# Altium schematic sheet SupplyBox.SchDoc
size C; SheetNumber: 1; SheetTotal: 1
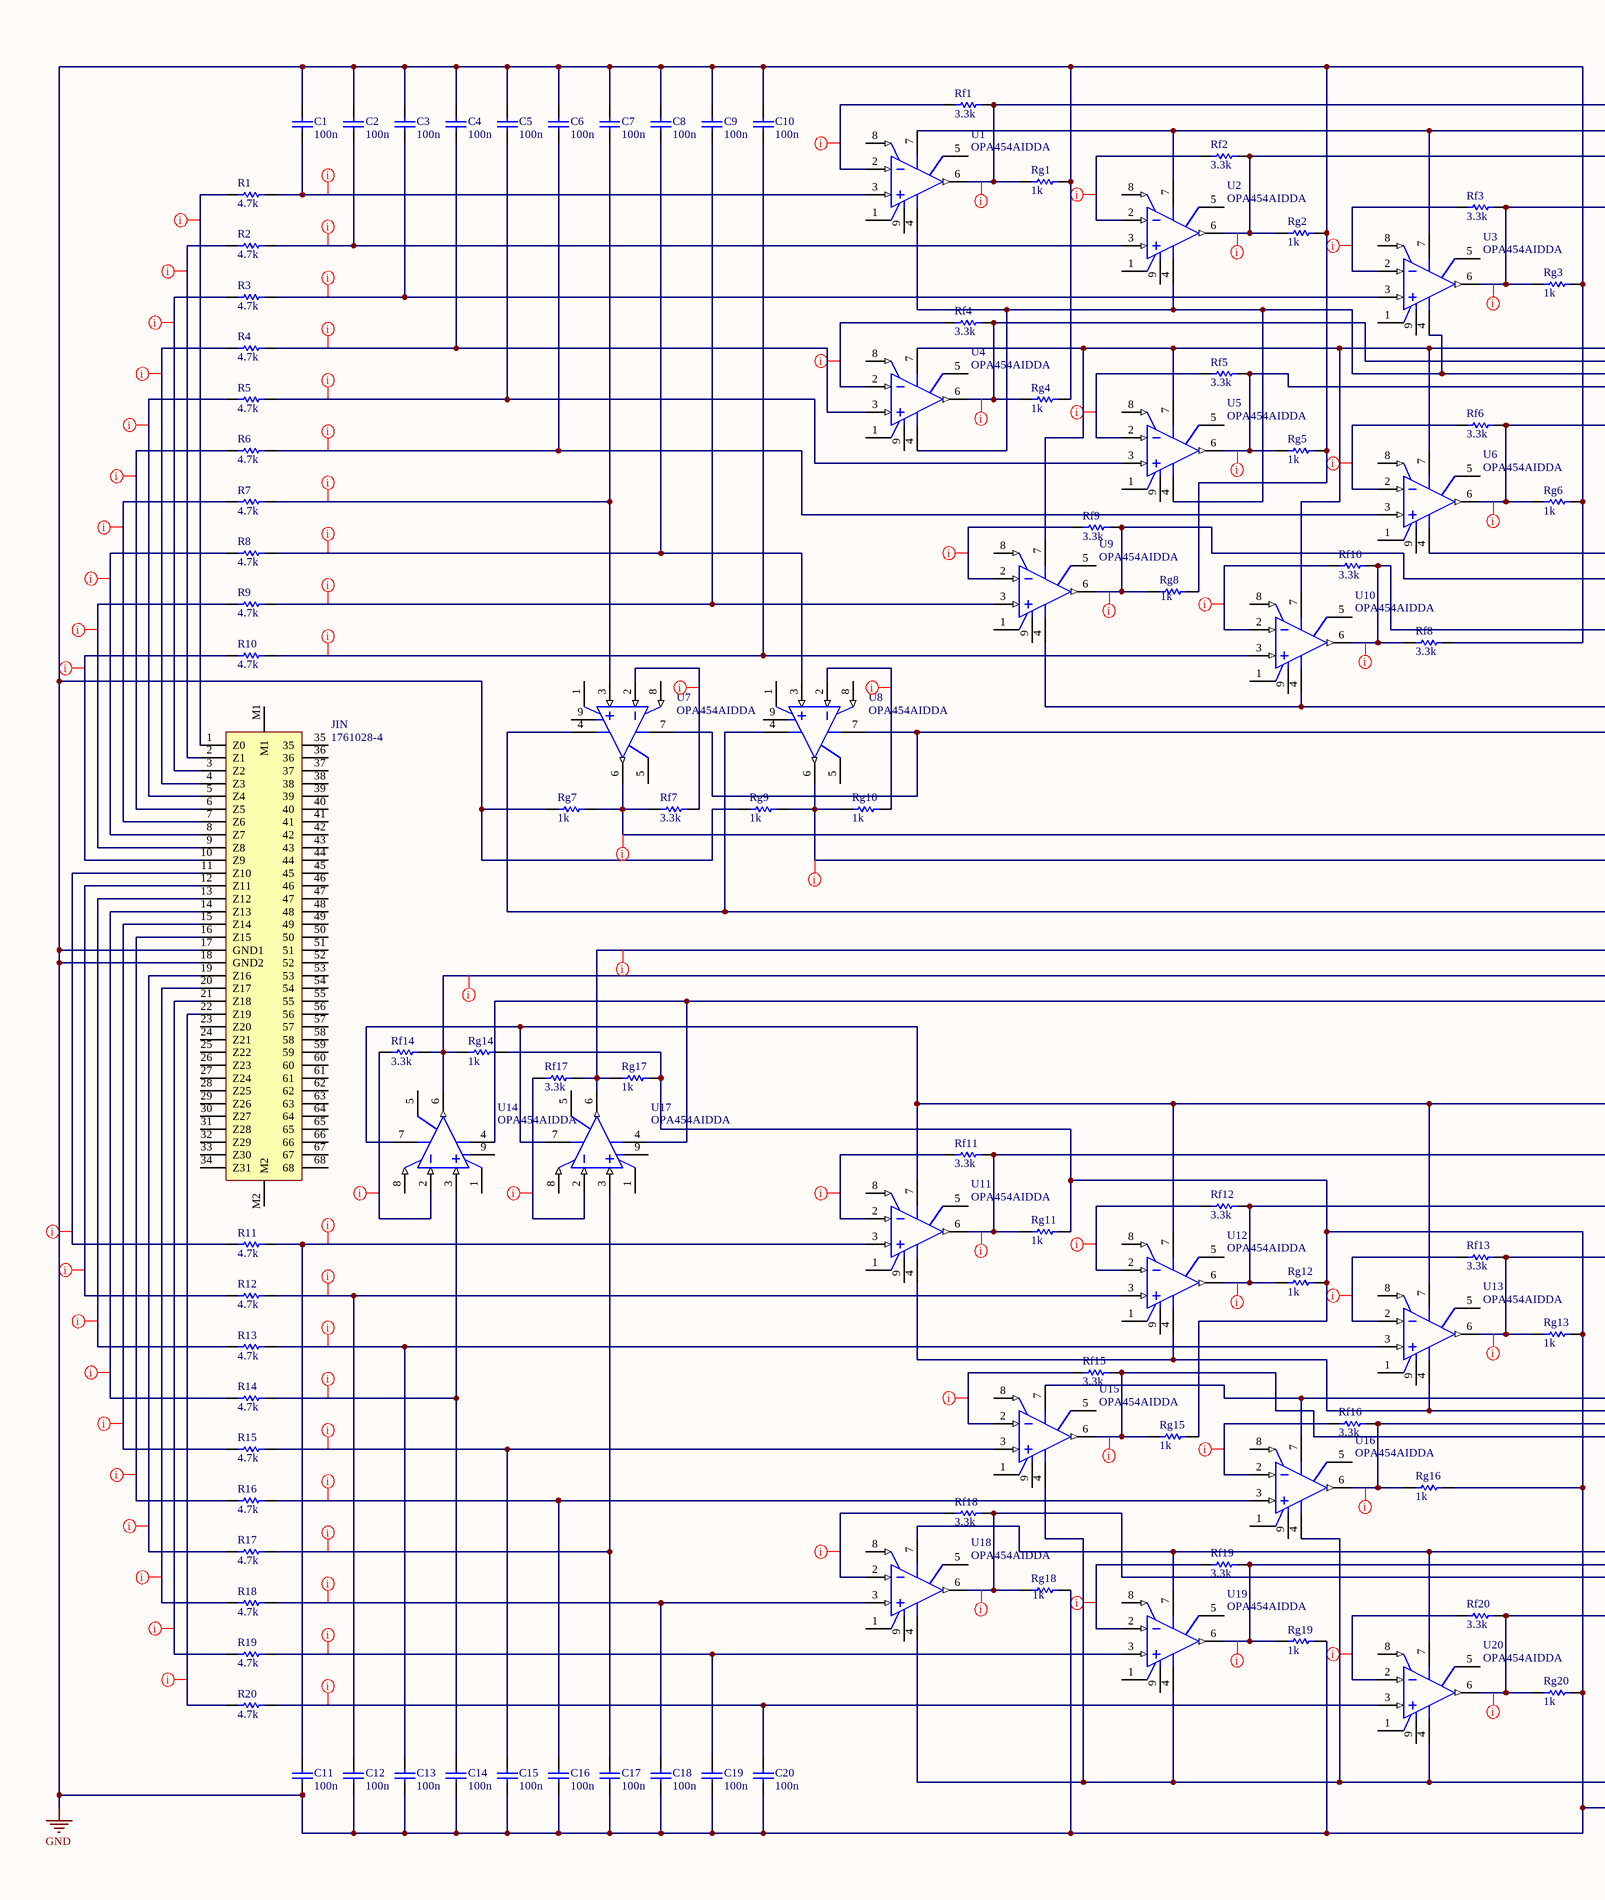
[diagram p0: SupplyBox.SchDoc, left]
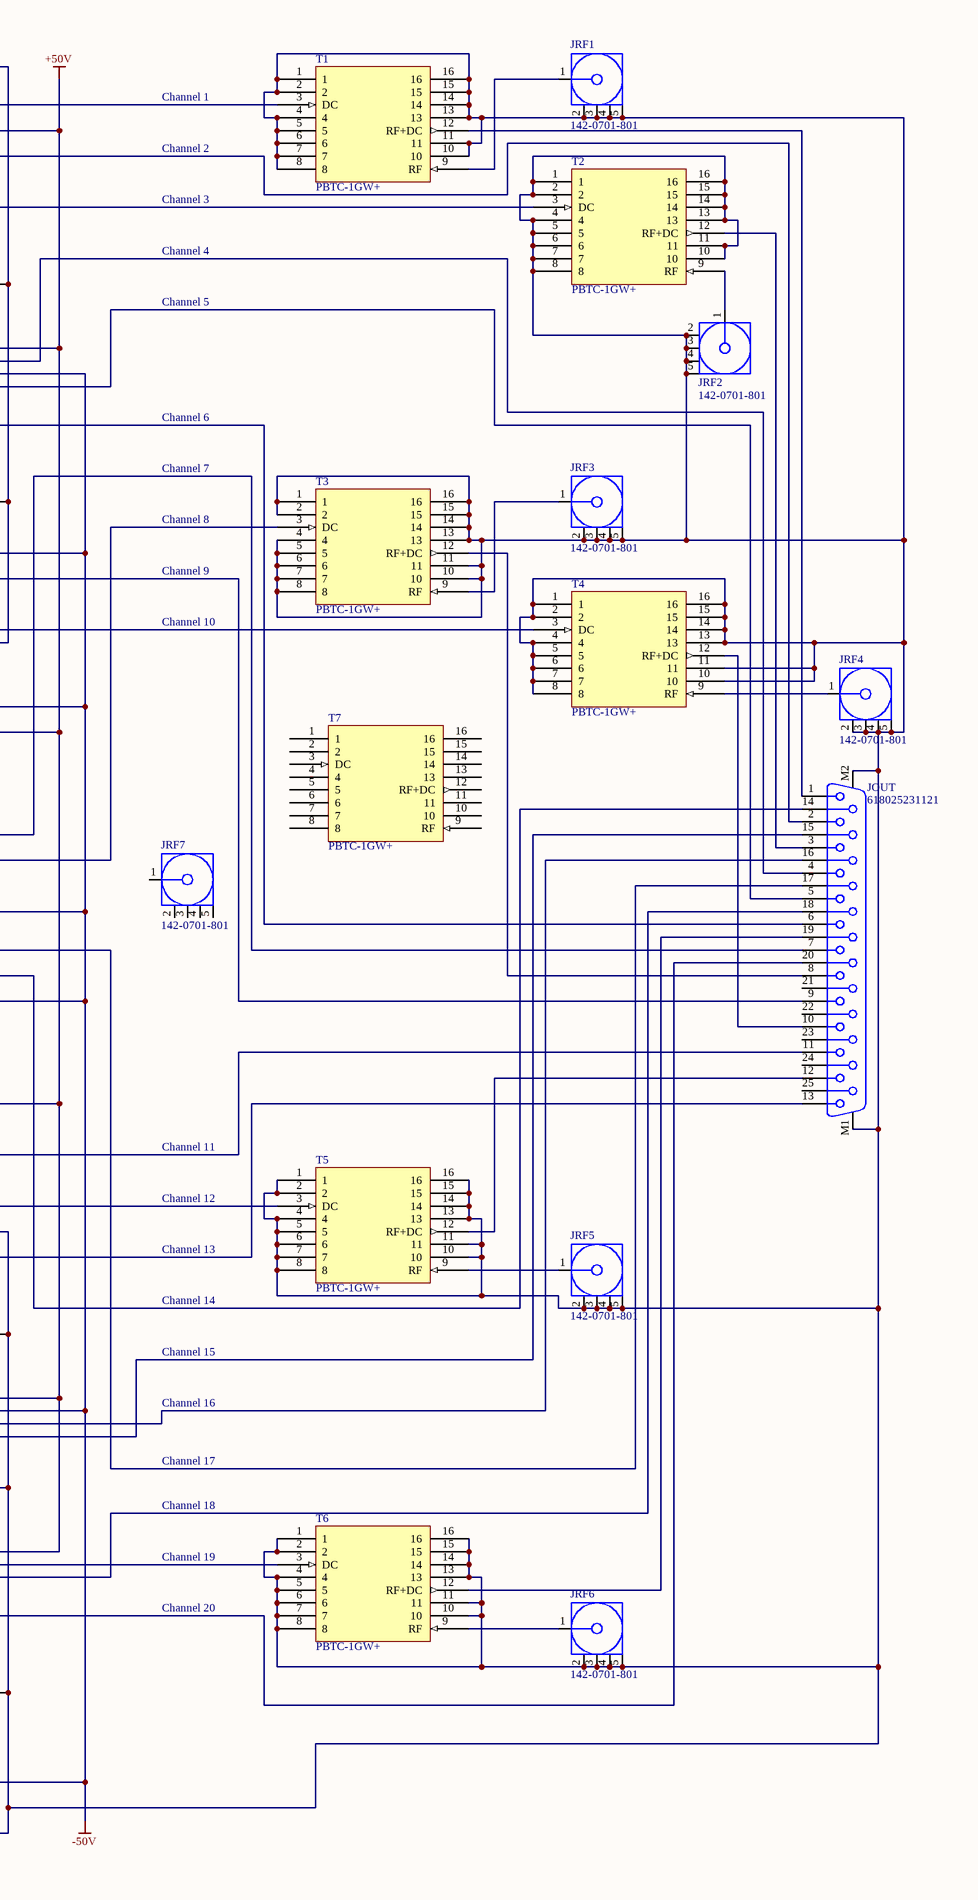
[diagram p1: SupplyBox.SchDoc, right]

## Parts
C1  100n  [CAPC2013X145X48NL20T23]
C2  100n  [CAPC2013X145X48NL20T23]
C3  100n  [CAPC2013X145X48NL20T23]
C4  100n  [CAPC2013X145X48NL20T23]
C5  100n  [CAPC2013X145X48NL20T23]
C6  100n  [CAPC2013X145X48NL20T23]
C7  100n  [CAPC2013X145X48NL20T23]
C8  100n  [CAPC2013X145X48NL20T23]
C9  100n  [CAPC2013X145X48NL20T23]
C10  100n  [CAPC2013X145X48NL20T23]
C11  100n  [CAPC2013X145X48NL20T23]
C12  100n  [CAPC2013X145X48NL20T23]
C13  100n  [CAPC2013X145X48NL20T23]
C14  100n  [CAPC2013X145X48NL20T23]
C15  100n  [CAPC2013X145X48NL20T23]
C16  100n  [CAPC2013X145X48NL20T23]
C17  100n  [CAPC2013X145X48NL20T23]
C18  100n  [CAPC2013X145X48NL20T23]
C19  100n  [CAPC2013X145X48NL20T23]
C20  100n  [CAPC2013X145X48NL20T23]
JIN  1761028-4  [1761028-4-Footprint-1]
JOUT  618025231121  [618025231121]
JRF1  142-0701-801  [CINC-142-0701-801_V]
JRF2  142-0701-801  [CINC-142-0701-801_V]
JRF3  142-0701-801  [CINC-142-0701-801_V]
JRF4  142-0701-801  [CINC-142-0701-801_V]
JRF5  142-0701-801  [CINC-142-0701-801_V]
JRF6  142-0701-801  [CINC-142-0701-801_V]
JRF7  142-0701-801  [CINC-142-0701-801_V]
R1  4.7k  [RESC2013X60X35NL10T20]
R2  4.7k  [RESC2013X60X35NL10T20]
R3  4.7k  [RESC2013X60X35NL10T20]
R4  4.7k  [RESC2013X60X35NL10T20]
R5  4.7k  [RESC2013X60X35NL10T20]
R6  4.7k  [RESC2013X60X35NL10T20]
R7  4.7k  [RESC2013X60X35NL10T20]
R8  4.7k  [RESC2013X60X35NL10T20]
R9  4.7k  [RESC2013X60X35NL10T20]
R10  4.7k  [RESC2013X60X35NL10T20]
R11  4.7k  [RESC2013X60X35NL10T20]
R12  4.7k  [RESC2013X60X35NL10T20]
R13  4.7k  [RESC2013X60X35NL10T20]
R14  4.7k  [RESC2013X60X35NL10T20]
R15  4.7k  [RESC2013X60X35NL10T20]
R16  4.7k  [RESC2013X60X35NL10T20]
R17  4.7k  [RESC2013X60X35NL10T20]
R18  4.7k  [RESC2013X60X35NL10T20]
R19  4.7k  [RESC2013X60X35NL10T20]
R20  4.7k  [RESC2013X60X35NL10T20]
Rf1  3.3k  [RESC2013X60X35ML10T20]
Rf2  3.3k  [RESC2013X60X35ML10T20]
Rf3  3.3k  [RESC2013X60X35ML10T20]
Rf4  3.3k  [RESC2013X60X35ML10T20]
Rf5  3.3k  [RESC2013X60X35ML10T20]
Rf6  3.3k  [RESC2013X60X35ML10T20]
Rf7  3.3k  [RESC2013X60X35ML10T20]
Rf8  3.3k  [RESC2013X60X35ML10T20]
Rf9  3.3k  [RESC2013X60X35ML10T20]
Rf10  3.3k  [RESC2013X60X35ML10T20]
Rf11  3.3k  [RESC2013X60X35ML10T20]
Rf12  3.3k  [RESC2013X60X35ML10T20]
Rf13  3.3k  [RESC2013X60X35ML10T20]
Rf14  3.3k  [RESC2013X60X35ML10T20]
Rf15  3.3k  [RESC2013X60X35ML10T20]
Rf16  3.3k  [RESC2013X60X35ML10T20]
Rf17  3.3k  [RESC2013X60X35ML10T20]
Rf18  3.3k  [RESC2013X60X35ML10T20]
Rf19  3.3k  [RESC2013X60X35ML10T20]
Rf20  3.3k  [RESC2013X60X35ML10T20]
Rg1  1k  [RESC2013X60X35ML10T20]
Rg2  1k  [RESC2013X60X35ML10T20]
Rg3  1k  [RESC2013X60X35ML10T20]
Rg4  1k  [RESC2013X60X35ML10T20]
Rg5  1k  [RESC2013X60X35ML10T20]
Rg6  1k  [RESC2013X60X35ML10T20]
Rg7  1k  [RESC2013X60X35ML10T20]
Rg8  1k  [RESC2013X60X35ML10T20]
Rg9  1k  [RESC2013X60X35ML10T20]
Rg10  1k  [RESC2013X60X35ML10T20]
Rg11  1k  [RESC2013X60X35ML10T20]
Rg12  1k  [RESC2013X60X35ML10T20]
Rg13  1k  [RESC2013X60X35ML10T20]
Rg14  1k  [RESC2013X60X35ML10T20]
Rg15  1k  [RESC2013X60X35ML10T20]
Rg16  1k  [RESC2013X60X35ML10T20]
Rg17  1k  [RESC2013X60X35ML10T20]
Rg18  1k  [RESC2013X60X35ML10T20]
Rg19  1k  [RESC2013X60X35ML10T20]
Rg20  1k  [RESC2013X60X35ML10T20]
T1  PBTC-1GW+  [PBTC-1GW+]
T2  PBTC-1GW+  [PBTC-1GW+]
T3  PBTC-1GW+  [PBTC-1GW+]
T4  PBTC-1GW+  [PBTC-1GW+]
T5  PBTC-1GW+  [PBTC-1GW+]
T6  PBTC-1GW+  [PBTC-1GW+]
T7  PBTC-1GW+  [PBTC-1GW+]
U1  OPA454AIDDA  [DDA0008C_L]
U2  OPA454AIDDA  [DDA0008C_L]
U3  OPA454AIDDA  [DDA0008C_L]
U4  OPA454AIDDA  [DDA0008C_L]
U5  OPA454AIDDA  [DDA0008C_L]
U6  OPA454AIDDA  [DDA0008C_L]
U7  OPA454AIDDA  [DDA0008C_L]
U8  OPA454AIDDA  [DDA0008C_L]
U9  OPA454AIDDA  [DDA0008C_L]
U10  OPA454AIDDA  [DDA0008C_L]
U11  OPA454AIDDA  [DDA0008C_L]
U12  OPA454AIDDA  [DDA0008C_L]
U13  OPA454AIDDA  [DDA0008C_L]
U14  OPA454AIDDA  [DDA0008C_L]
U15  OPA454AIDDA  [DDA0008C_L]
U16  OPA454AIDDA  [DDA0008C_L]
U17  OPA454AIDDA  [DDA0008C_L]
U18  OPA454AIDDA  [DDA0008C_L]
U19  OPA454AIDDA  [DDA0008C_L]
U20  OPA454AIDDA  [DDA0008C_L]

## Nets
+50V: U1.7(V+) U2.7(V+) U3.7(V+) U4.7(V+) U5.7(V+) U6.7(V+) U7.7(V+) U8.7(V+) U9.7(V+) U10.7(V+) U11.7(V+) U12.7(V+) U13.7(V+) U14.7(V+) U15.7(V+) U16.7(V+) U17.7(V+) U18.7(V+) U19.7(V+) U20.7(V+)
-50V: U1.4(V-) U2.4(V-) U3.4(V-) U4.4(V-) U5.4(V-) U6.4(V-) U7.4(V-) U8.4(V-) U9.4(V-) U10.4(V-) U11.4(V-) U12.4(V-) U13.4(V-) U14.4(V-) U15.4(V-) U16.4(V-) U17.4(V-) U18.4(V-) U19.4(V-) U20.4(V-)
GND: C1.2 C2.2 C3.2 C4.2 C5.2 C6.2 C7.2 C8.2 C9.2 C10.2 C11.1 C12.1 C13.1 C14.1 C15.1 C16.1 C17.1 C18.1 C19.1 C20.1 JIN.17(GND1) JIN.18(GND2) JOUT.M1 JOUT.M2 JRF1.2 JRF1.3 JRF1.4 JRF1.5 JRF2.2 JRF2.3 JRF2.4 JRF2.5 JRF3.2 JRF3.3 JRF3.4 JRF3.5 JRF4.2 JRF4.3 JRF4.4 JRF4.5 JRF5.2 JRF5.3 JRF5.4 JRF5.5 JRF6.2 JRF6.3 JRF6.4 JRF6.5 Rf8.2 Rg1.2 Rg2.2 Rg3.2 Rg4.2 Rg5.2 Rg6.2 Rg7.1 Rg8.2 Rg9.1 Rg11.2 Rg12.2 Rg13.2 Rg14.2 Rg15.2 Rg16.2 Rg17.2 Rg18.2 Rg19.2 Rg20.2 T1.1 T1.2 T1.4 T1.5 T1.6 T1.7 T1.8 T1.10 T1.11 T1.13 T1.14 T1.15 T1.16 T2.1 T2.2 T2.4 T2.5 T2.6 T2.7 T2.8 T2.10 T2.11 T2.13 T2.14 T2.15 T2.16 T3.1 T3.2 T3.4 T3.5 T3.6 T3.7 T3.8 T3.10 T3.11 T3.13 T3.14 T3.15 T3.16 T4.1 T4.2 T4.4 T4.5 T4.6 T4.7 T4.8 T4.10 T4.11 T4.13 T4.14 T4.15 T4.16 T5.1 T5.2 T5.4 T5.5 T5.6 T5.7 T5.8 T5.10 T5.11 T5.13 T5.14 T5.15 T5.16 T6.1 T6.2 T6.4 T6.5 T6.6 T6.7 T6.8 T6.10 T6.11 T6.13 T6.14 T6.15 T6.16
NetC1_1: C1.1 R1.2 U1.3(IN+)
NetC2_1: C2.1 R2.2 U2.3(IN+)
NetC3_1: C3.1 R3.2 U3.3(IN+)
NetC4_1: C4.1 R4.2 U4.3(IN+)
NetC5_1: C5.1 R5.2 U5.3(IN+)
NetC6_1: C6.1 R6.2 U6.3(IN+)
NetC7_1: C7.1 R7.2 U7.3(IN+)
NetC8_1: C8.1 R8.2 U8.3(IN+)
NetC9_1: C9.1 R9.2 U9.3(IN+)
NetC10_1: C10.1 R10.2 U10.3(IN+)
NetC11_2: C11.2 R11.2 U11.3(IN+)
NetC12_2: C12.2 R12.2 U12.3(IN+)
NetC13_2: C13.2 R13.2 U13.3(IN+)
NetC14_2: C14.2 R14.2 U14.3(IN+)
NetC15_2: C15.2 R15.2 U15.3(IN+)
NetC16_2: C16.2 R16.2 U16.3(IN+)
NetC17_2: C17.2 R17.2 U17.3(IN+)
NetC18_2: C18.2 R18.2 U18.3(IN+)
NetC19_2: C19.2 R19.2 U19.3(IN+)
NetC20_2: C20.2 R20.2 U20.3(IN+)
NetJIN_1: JIN.1(Z0) R1.1
NetJIN_2: JIN.2(Z1) R2.1
NetJIN_3: JIN.3(Z2) R3.1
NetJIN_4: JIN.4(Z3) R4.1
NetJIN_5: JIN.5(Z4) R5.1
NetJIN_6: JIN.6(Z5) R6.1
NetJIN_7: JIN.7(Z6) R7.1
NetJIN_8: JIN.8(Z7) R8.1
NetJIN_9: JIN.9(Z8) R9.1
NetJIN_10: JIN.10(Z9) R10.1
NetJIN_11: JIN.11(Z10) R11.1
NetJIN_12: JIN.12(Z11) R12.1
NetJIN_13: JIN.13(Z12) R13.1
NetJIN_14: JIN.14(Z13) R14.1
NetJIN_15: JIN.15(Z14) R15.1
NetJIN_16: JIN.16(Z15) R16.1
NetJIN_19: JIN.19(Z16) R17.1
NetJIN_20: JIN.20(Z17) R18.1
NetJIN_21: JIN.21(Z18) R19.1
NetJIN_22: JIN.22(Z19) R20.1
NetJOUT_1: JOUT.1 T1.12(RF+DC)
NetJOUT_2: JOUT.2 Rf2.2 Rg2.1 U2.6(OUT)
NetJOUT_3: JOUT.3 T2.12(RF+DC)
NetJOUT_4: JOUT.4 Rf4.2 Rg4.1 U4.6(OUT)
NetJOUT_5: JOUT.5 Rf5.2 Rg5.1 U5.6(OUT)
NetJOUT_6: JOUT.6 Rf6.2 Rg6.1 U6.6(OUT)
NetJOUT_7: JOUT.7 Rf7.1 Rg7.2 U7.6(OUT)
NetJOUT_8: JOUT.8 T3.12(RF+DC)
NetJOUT_9: JOUT.9 Rf9.2 Rg8.1 U9.6(OUT)
NetJOUT_10: JOUT.10 T4.12(RF+DC)
NetJOUT_11: JOUT.11 Rf11.2 Rg11.1 U11.6(OUT)
NetJOUT_12: JOUT.12 T5.12(RF+DC)
NetJOUT_13: JOUT.13 Rf13.2 Rg13.1 U13.6(OUT)
NetJOUT_14: JOUT.14 Rf14.2 Rg14.1 U14.6(OUT)
NetJOUT_15: JOUT.15 Rf15.2 Rg15.1 U15.6(OUT)
NetJOUT_16: JOUT.16 Rf16.2 Rg16.1 U16.6(OUT)
NetJOUT_17: JOUT.17 Rf17.2 Rg17.1 U17.6(OUT)
NetJOUT_18: JOUT.18 Rf18.2 Rg18.1 U18.6(OUT)
NetJOUT_19: JOUT.19 T6.12(RF+DC)
NetJOUT_20: JOUT.20 Rf20.2 Rg20.1 U20.6(OUT)
NetJRF1_1: JRF1.1 T1.9(RF)
NetJRF2_1: JRF2.1 T2.9(RF)
NetJRF3_1: JRF3.1 T3.9(RF)
NetJRF4_1: JRF4.1 T4.9(RF)
NetJRF5_1: JRF5.1 T5.9(RF)
NetJRF6_1: JRF6.1 T6.9(RF)
NetRf1_1: Rf1.1 U1.2(IN-)
NetRf1_2: Rf1.2 Rg1.1 T1.3(DC) U1.6(OUT)
NetRf2_1: Rf2.1 U2.2(IN-)
NetRf3_1: Rf3.1 U3.2(IN-)
NetRf3_2: Rf3.2 Rg3.1 T2.3(DC) U3.6(OUT)
NetRf4_1: Rf4.1 U4.2(IN-)
NetRf5_1: Rf5.1 U5.2(IN-)
NetRf6_1: Rf6.1 U6.2(IN-)
NetRf7_2: Rf7.2 U7.2(IN-)
NetRf8_1: Rf8.1 Rf10.2 T4.3(DC) U10.6(OUT)
NetRf9_1: Rf9.1 U9.2(IN-)
NetRf10_1: Rf10.1 U10.2(IN-)
NetRf11_1: Rf11.1 U11.2(IN-)
NetRf12_1: Rf12.1 U12.2(IN-)
NetRf12_2: Rf12.2 Rg12.1 T5.3(DC) U12.6(OUT)
NetRf13_1: Rf13.1 U13.2(IN-)
NetRf14_1: Rf14.1 U14.2(IN-)
NetRf15_1: Rf15.1 U15.2(IN-)
NetRf16_1: Rf16.1 U16.2(IN-)
NetRf17_1: Rf17.1 U17.2(IN-)
NetRf18_1: Rf18.1 U18.2(IN-)
NetRf19_1: Rf19.1 U19.2(IN-)
NetRf19_2: Rf19.2 Rg19.1 T6.3(DC) U19.6(OUT)
NetRf20_1: Rf20.1 U20.2(IN-)
NetRg9_2: Rg9.2 Rg10.1 T3.3(DC) U8.6(OUT)
NetRg10_2: Rg10.2 U8.2(IN-)

Not connected (* = marked no-connect by the designer): JIN 23(Z20) 24(Z21) 25(Z22) 26(Z23) 27(Z24) 28(Z25) 29(Z26) 30(Z27) 31(Z28) 32(Z29) 33(Z30) 34(Z31) 35 36 37 38 39 40 41 42 43 44 45 46 47 48 49 50 51 52 53 54 55 56 57 58 59 60 61 62 63 64 65 66 67 68 M1 M2; JOUT 21 22 23 24 25; JRF7 1 2 3 4 5; T7 1 2 3(DC) 4 5 6 7 8 9(RF) 10 11 12(RF+DC) 13 14 15 16; U1 1(E/D_COM) 5(STATUS_FLAG) 8(E/D) 9(EP); U2 1(E/D_COM) 5(STATUS_FLAG) 8(E/D) 9(EP); U3 1(E/D_COM) 5(STATUS_FLAG) 8(E/D) 9(EP); U4 1(E/D_COM) 5(STATUS_FLAG) 8(E/D) 9(EP); U5 1(E/D_COM) 5(STATUS_FLAG) 8(E/D) 9(EP); U6 1(E/D_COM) 5(STATUS_FLAG) 8(E/D) 9(EP); U7 1(E/D_COM) 5(STATUS_FLAG) 8(E/D) 9(EP); U8 1(E/D_COM) 5(STATUS_FLAG) 8(E/D) 9(EP); U9 1(E/D_COM) 5(STATUS_FLAG) 8(E/D) 9(EP); U10 1(E/D_COM) 5(STATUS_FLAG) 8(E/D) 9(EP); U11 1(E/D_COM) 5(STATUS_FLAG) 8(E/D) 9(EP); U12 1(E/D_COM) 5(STATUS_FLAG) 8(E/D) 9(EP); U13 1(E/D_COM) 5(STATUS_FLAG) 8(E/D) 9(EP); U14 1(E/D_COM) 5(STATUS_FLAG) 8(E/D) 9(EP); U15 1(E/D_COM) 5(STATUS_FLAG) 8(E/D) 9(EP); U16 1(E/D_COM) 5(STATUS_FLAG) 8(E/D) 9(EP); U17 1(E/D_COM) 5(STATUS_FLAG) 8(E/D) 9(EP); U18 1(E/D_COM) 5(STATUS_FLAG) 8(E/D) 9(EP); U19 1(E/D_COM) 5(STATUS_FLAG) 8(E/D) 9(EP); U20 1(E/D_COM) 5(STATUS_FLAG) 8(E/D) 9(EP)

## Layout directives
net class Before_Filter: NetJIN_1, NetJIN_2, NetJIN_3, NetJIN_4, NetJIN_5, NetJIN_6, NetJIN_7, NetJIN_8, NetJIN_9, NetJIN_10, NetJIN_11, NetJIN_12, NetJIN_13, NetJIN_14, NetJIN_15, NetJIN_16, NetJIN_19, NetJIN_20, NetJIN_21, NetJIN_22
net class Filter_Amplifier: NetC1_1, NetC2_1, NetC3_1, NetC4_1, NetC5_1, NetC6_1, NetC7_1, NetC8_1, NetC9_1, NetC10_1, NetC11_2, NetC12_2, NetC13_2, NetC14_2, NetC15_2, NetC16_2, NetC17_2, NetC18_2, NetC19_2, NetC20_2
net class Amplifier_feedback: NetRf1_1, NetRf2_1, NetRf3_1, NetRf4_1, NetRf5_1, NetRf6_1, NetRf7_2, NetRf9_1, NetRf10_1, NetRf11_1, NetRf12_1, NetRf13_1, NetRf14_1, NetRf15_1, NetRf16_1, NetRf17_1, NetRf18_1, NetRf19_1, NetRf20_1, NetRg10_2
net class Amplifier_Output: NetJOUT_2, NetJOUT_4, NetJOUT_5, NetJOUT_6, NetJOUT_7, NetJOUT_9, NetJOUT_11, NetJOUT_13, NetJOUT_14, NetJOUT_15, NetJOUT_16, NetJOUT_17, NetJOUT_18, NetJOUT_20, NetRf1_2, NetRf3_2, NetRf8_1, NetRf12_2, NetRf19_2, NetRg9_2

## Notes on the sheet
- Channel 1
- Channel 2
- Channel 3
- Channel 4
- Channel 5
- Channel 6
- Channel 7
- Channel 8
- Channel 9
- Channel 10
- Channel 11
- Channel 12
- Channel 13
- Channel 14
- Channel 15
- Channel 16
- Channel 17
- Channel 18
- Channel 19
- Channel 20

## Library data of the parts
C1-C20 = CMP-2007-03167-1: Manufacturer: Vitramon; Part Number: VJ0805Y104KNAAT
JIN = CMP-002-00071-1: Telecom and Datacom Connector, 68 Contact(s), Female, Right Angle, Solder Terminal, #2-56, Receptacle; Connector Type: TELECOM AND DATACOM CONNECTOR; Mounting Technology: Panel,Board; Max Operating Temperature: 105°C; Min Operating Temperature: -55°C; RoHS Compliant: Yes
JOUT = CMP-1502-00202-2: NexarPartId: 18818207; Pitch: 2.77mm; Operating Supply Voltage: 125V; Gender: Female; Insulation Resistance: 5GΩ; Contact Resistance: 30mΩ; Current Rating: 3A; Number of Contacts: 25; Contact Plating: Gold; Width: 12.5mm; RoHS: Compliant; REACH SVHC: Unknown; Min Operating Temperature: -55°C; Termination: SMD/SMT; Voltage Rating: 125V; Mount: Through Hole; Housing Material: Steel; Insulation Material: PBT; Number of Rows: 2; Depth: 18.5mm; Orientation: Right Angle; Number of Pins: 25; Max Operating Temperature: 105°C; Length: 38.33mm
JRF1-JRF7 = CMP-2000-05490-1: SMA End Launch Jack Receptacle, 50 Ohm, 0 to 18 GHz, -65 to 165 degC, 5-Pin SMD, RoHS, Bulk; Manufacturer: EmersonConnectivitySolutions; Connector Type: JackPCB; Gender: Jack(Female); Impedance: 50Ohms; Brand: Johnson/EmersonConnectivitySolutions; Body Material: Brass; Body Style: Straight; Maximum Frequency: 18GHz; Factory Pack Quantity: 5; Datasheet URL: https://belfuse.com/resources/Johnson/productinformation/pi-142-0701-801.pdf; Datasheet Version: 12/2014; Operating Temperature Range: -65Cto+165C; Mounting Technology: SurfaceMount; RF Series: SMA; Package Reference: 142-0701-801; Product Category: RFConnectors/CoaxialConnectors; Termination Style: Solder; RoHS: Details; Package URL: https://belfuse.com/resources/Johnson/drawings/dr-1420701801.pdf; Series: SMA; Package Description: 5-Pin Surface Mount Device, Body 14.275 x 9.525 mm; Manufacturer URL: http://www.cinch.com/; Contact Plating: Gold; Product: Connectors; Orientation: Straight
R1-R20 = CMP-1659-00011-4: Chip Resistor, 47 KOhm, +/- 1%, 0.125 W, -55 to 155 degC, 0805 (2012 Metric), RoHS, Tape and Reel; Manufacturer: Yageo; Voltage Rating: 150 V; Height: 0.5 mm; ComponentLink2URL: http://www.yageo.com/documents/recent/PYu-RC_Group_51_RoHS_L_04.pdf; ComponentLink2Description: Datasheet; Package Quantity: 200; Max Operating Temperature: 155 degC; Min Operating Temperature: -55 degC; Packaging: Tape and Reel; Pins: 2; PackageReference: 0805; Mounting Technology: Surface Mount; ComponentLink1Description: Manufacturer URL; ComponentLink1URL: http://www.yageo.com/; PackageDescription: 2-Pin Surface Mounted Device, Body 2 x 1.25 mm; Length: 2 mm; REACH SVHC: No SVHC; Mount: Surface Mount; RoHSCompliant: true; DatasheetVersion: Rev. 4, 02/2016
Rf1-Rf20 = CMP-1013-00567-2: Chip Resistor, 3.3 KOhm, +/- 1%, 0.125 W, -55 to 155 degC, 0805 (2012 Metric), RoHS, Tape and Reel; Manufacturer: Yageo; Voltage Rating: 150V; Max Power Dissipation: 125mW; Temperature Coefficient: 100ppm/degreesC; Package Quantity: 1; Max Operating Temperature: 155degC; Case Code (Metric): 2012; Package Reference: 0805; Resistance: 3.3KOhm; Composition: ThickFilm; RoHSCompliant: true; Case/Package: 0805; Case Code (Imperial): 0805; Tolerance: 1%; Depth: 1.25mm; Weight: 0.000194oz; Lead Free: LeadFree; Min Operating Temperature: -55degC; Termination: SMD/SMT; Datasheet Version: Rev. 5, 10/2016; REACH SVHC: NoSVHC; Power Rating: 125mW; Packaging: TapeandReel; Number of Terminations: 2; Width: 0.049inch; Package Description: 2-Pin Surface Mounted Device, Body 2 x 1.25 mm; Datasheet URL: http://www.yageo.com/NewPortal/yageodocoutput?fileName=/pdf/R-Chip/PYu-RC_Group_51_RoHS_L_5.pdf; Height: 0.5mm; Length: 2mm; Manufacturer URL: http://www.yageo.com/
Rg1-Rg20 = CMP-2100-03671-1: Chip Resistor, 1 KOhm, +/- 1%, 125 mW, -55 to 155 degC, 0805 (2012 Metric), RoHS, Tape and Reel; Manufacturer: Yageo; Temperature Coefficient: 100ppm/degreesC; Voltage Rating (DC): 150V; Max Power Dissipation: 125mW; Resistance: 1KOhm; Number of Pins: 2; Number of Terminations: 2; Datasheet URL: http://www.yageo.com/NewPortal/yageodocoutput?fileName=/pdf/R-Chip/PYu-RC_Group_51_RoHS_L_5.pdf; Length: 0.079inch; Package Description: 2-Pin Surface Mounted Device, Body 2 x 1.25 mm; Depth: 1.25mm; Height: 0.024inch; Military Standard: Not; Case/Package: 0805; Package Reference: 0805; RoHSCompliant: true; Lead Free: LeadFree; Packaging: TapeandReel; Package Quantity: 1; Datasheet Version: Rev. 5, 10/2016; Tolerance: 1%; Min Operating Temperature: -55degC; Voltage Rating: 150V; Composition: ThickFilm; Case Code (Imperial): 0805; Power Rating: 125mW; Width: 0.049inch; Case Code (Metric): 2012; Manufacturer URL: http://www.yageo.com/; Max Operating Temperature: 155degC; REACH SVHC: Unknown; Termination: SMD/SMT
T1-T7 = CMP-00025-00003-1: Monitor TEE DC Block, 0.1MHz Min, 1000MHz Max, 1dB Insertion Loss-Max; Min Operating Temperature: -55°C; Max Operating Temperature: 100°C; RoHS Compliant: Yes
U1-U20 = CMP-0017-00714-2: High Voltage (100V), High-Current (50mA) Operational Amplifier, G=1 Stable, 10 to 100 V, -55 to 125 degC, 8-pin SOP (DDA8), Green (RoHS & no Sb/Br); Manufacturer: Texas Instruments; Number of Channels: 1; CMRR(Min)(dB): 100; Rating: Catalog; Total Supply Voltage(Min)(+5V is 5, +/-5V is 10): 10; Offset Drift(Typ)(uV/C): 1.6; Vn at 1kHz(Typ)(nV/rtHz): 47; Slew Rate(Typ)(V/us): 13; Sub Family: General Purpose Amplifier, High Output Current Amplifier (>=50mA), High Supply Voltage Amplifier (>=30V), Precision Amplifier; Iq per channel(Max)(mA): 4; GBW(Typ)(MHz): 2.5; Code_JEDEC: MS-012; ComponentLink3URL: http://www.ti.com/litv/pdf/mpds092e; ComponentLink1Description: Manufacturer URL; PackageDescription: 8-Pin PowerPAD(TM) Plastic Small Outline, Body 3.9 x 4.9 mm, Pitch 1.27 mm; PackageVersion: 4202561/F, 12/2011; ComponentLink3Description: Package Specification; ComponentLink2URL: http://www.ti.com/lit/ds/symlink/opa454.pdf; ComponentLink2Description: Datasheet; IIB(Max)(pA): 100; ComponentLink1URL: http://www.ti.com/; DatasheetVersion: SBOS391A; Total Supply Voltage(Max)(+5V is 5, +/-5V is 10): 100; Eco-Plan: Green (RoHS & no Sb/Br); Mounting Technology: Surface Mount; Vio (25C)(Max)(mV): 4; PackageReference: DDA0008C; PartNumber: OPA454AIDDA